# Altium schematic sheet STLINK_V3EC.SchDoc: STLINK-V3EC
size A3; Date: Not used; ApprovedBy: Not used; CheckedBy: Not used; Author: Not used; CompanyName: STMicroelectronics; DrawnBy: Not used; Engineer: Not used; Organization: Not used; Address1: Not used; Address2: Not used; Address3: Not used; Address4: Not used; DocumentNumber: Not used; Revision: V0.1; SheetNumber: 18; SheetTotal: 18; CurrentTime: Not used; CurrentDate: Not used; Time: Not used; DocumentFullPathAndName: Not used; DocumentName: Not used; ModifiedDate: Not used; ImagePath: Not used; ProjectName: Not used; Application_BuildNumber: Not used
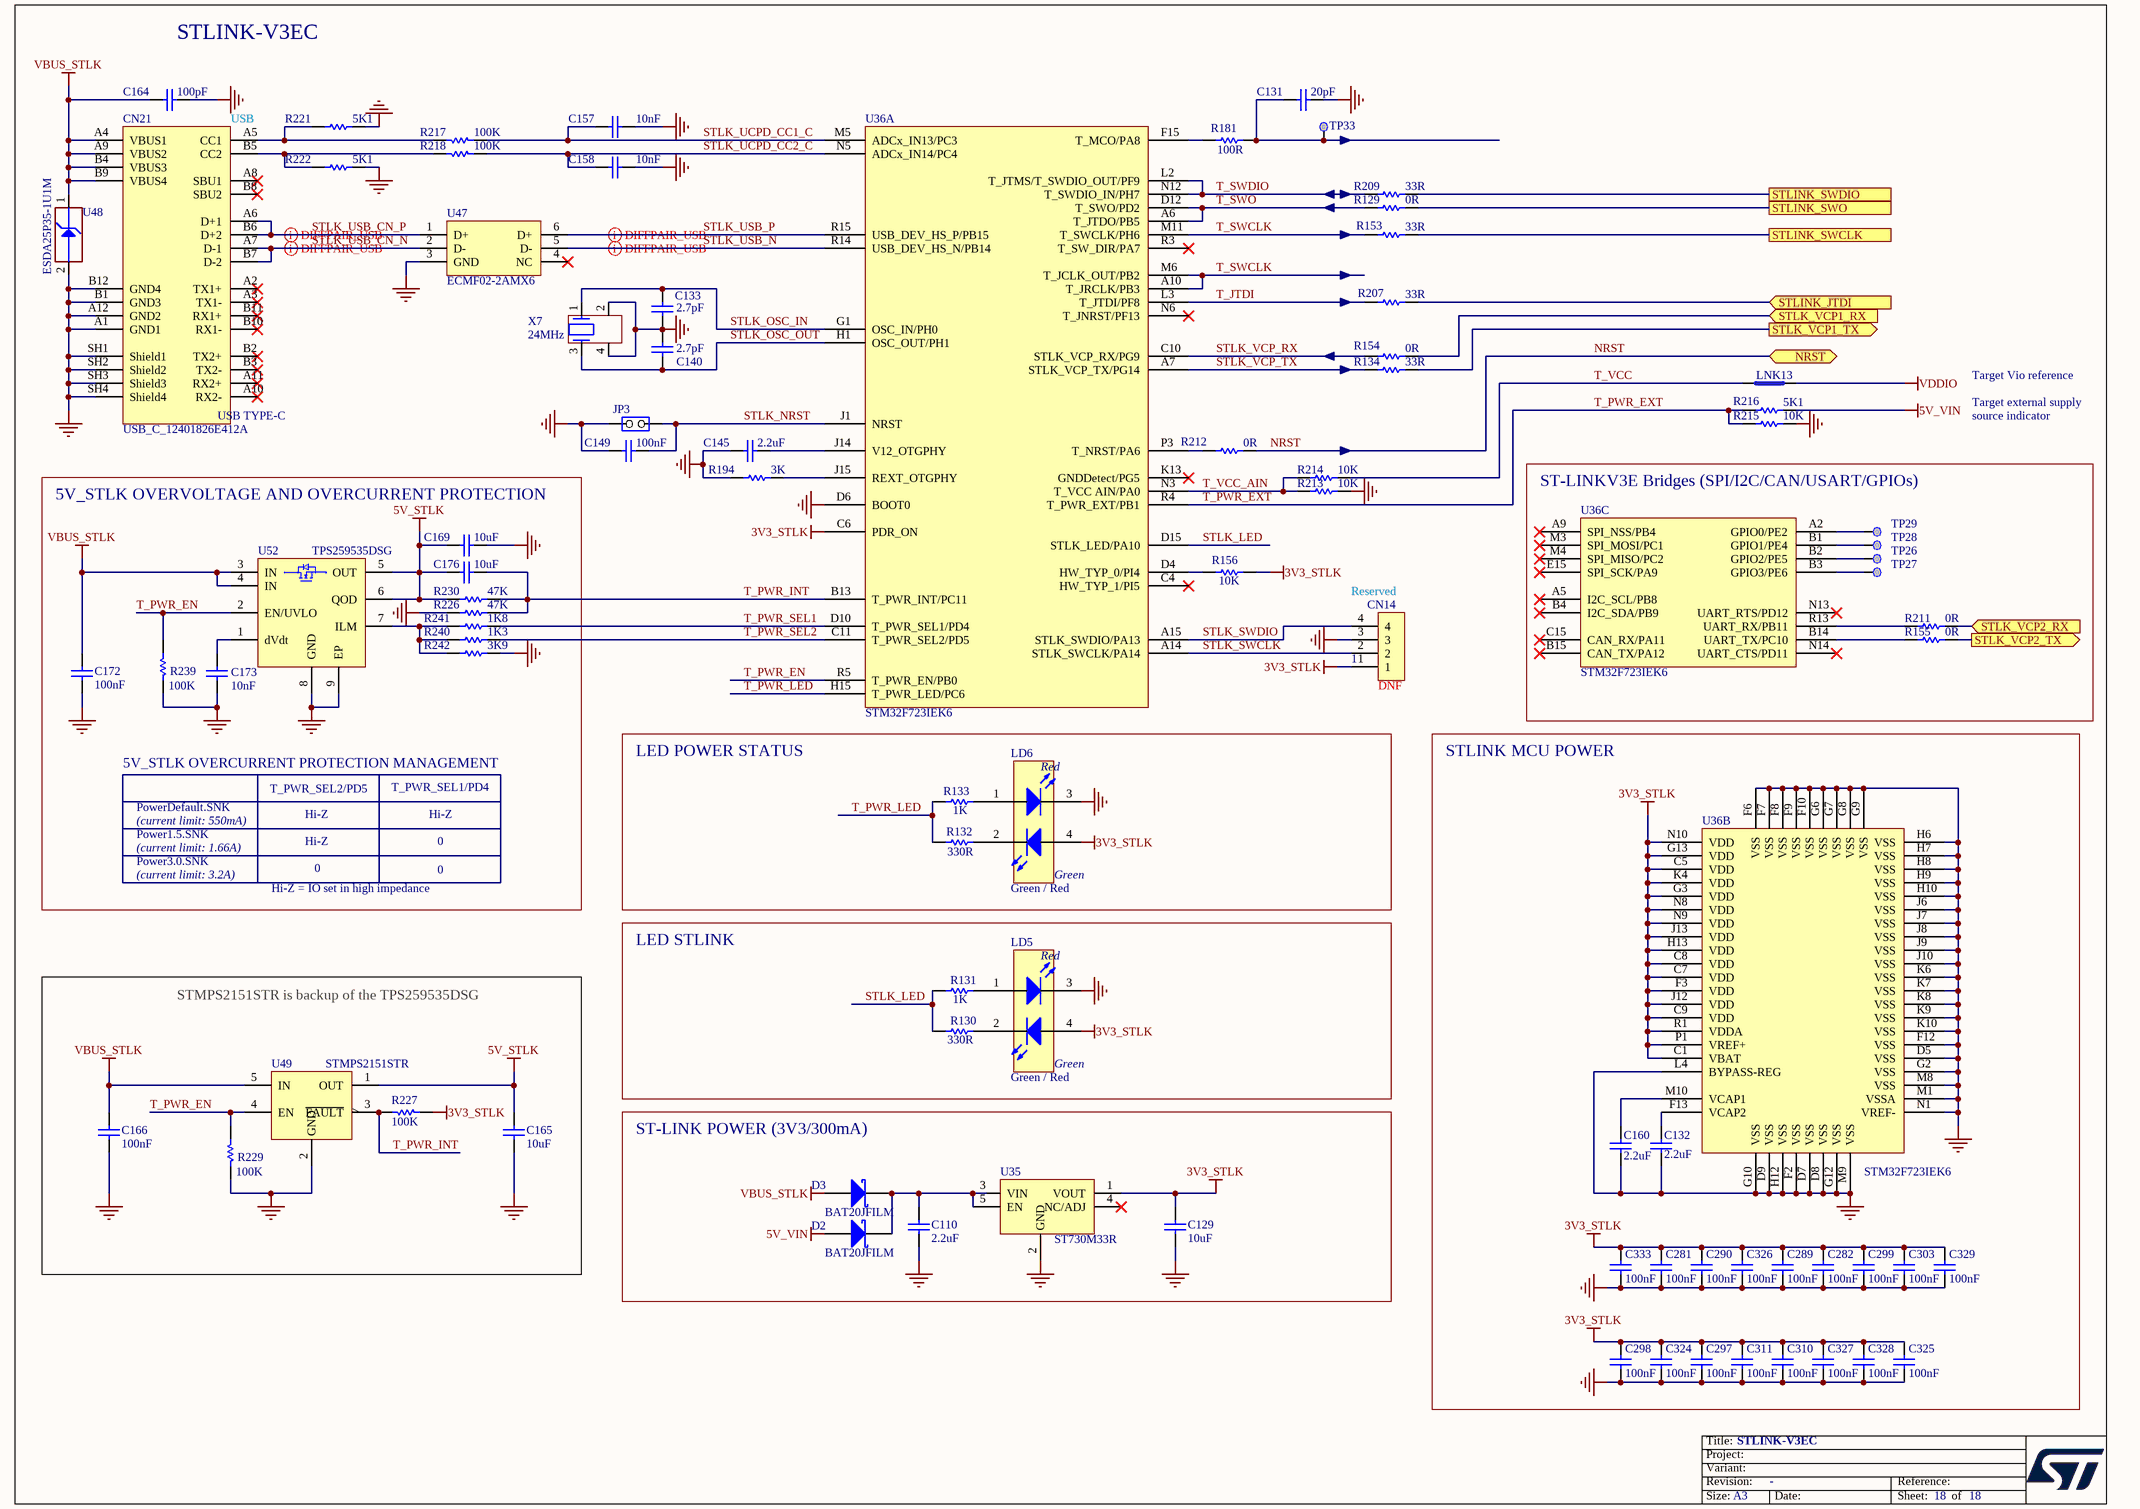
[diagram p0: STLINK_V3EC.SchDoc]

## Parts
C110  value 2.2uF  [C0805]  (hidden comment: Capacitor)
C129  value 10uF  [C0603]  (hidden comment: Capacitor)
C131  value 20pF  [C0402]  (hidden comment: Capacitor)
C132  value 2.2uF  [C0402]  (hidden comment: Capacitor)
C133  value 2.7pF  [C0402]  (hidden comment: Capacitor)
C140  value 2.7pF  [C0402]  (hidden comment: Capacitor)
C145  value 2.2uF  [C0402]  (hidden comment: Capacitor)
C149  value 100nF  [C0402]  (hidden comment: Capacitor)
C157  value 10nF  [C0402]  (hidden comment: Capacitor)
C158  value 10nF  [C0402]  (hidden comment: Capacitor)
C160  value 2.2uF  [C0402]  (hidden comment: Capacitor)
C164  value 100pF  [C0402]  (hidden comment: Capacitor)
C165  value 10uF  [C0603]  (hidden comment: Capacitor)
C166  value 100nF  [C0402]  (hidden comment: Capacitor)
C169  value 10uF  [C0603]  (hidden comment: Capacitor)
C172  value 100nF  [C0402]  (hidden comment: Capacitor)
C173  value 10nF  [C0402]  (hidden comment: Capacitor)
C176  value 10uF  [C0402]  (hidden comment: Capacitor)
C281  value 100nF  [C0402]  (hidden comment: Capacitor)
C282  value 100nF  [C0402]  (hidden comment: Capacitor)
C289  value 100nF  [C0402]  (hidden comment: Capacitor)
C290  value 100nF  [C0402]  (hidden comment: Capacitor)
C297  value 100nF  [C0402]  (hidden comment: Capacitor)
C298  value 100nF  [C0402]  (hidden comment: Capacitor)
C299  value 100nF  [C0402]  (hidden comment: Capacitor)
C303  value 100nF  [C0402]  (hidden comment: Capacitor)
C310  value 100nF  [C0402]  (hidden comment: Capacitor)
C311  value 100nF  [C0402]  (hidden comment: Capacitor)
C324  value 100nF  [C0402]  (hidden comment: Capacitor)
C325  value 100nF  [C0402]  (hidden comment: Capacitor)
C326  value 100nF  [C0402]  (hidden comment: Capacitor)
C327  value 100nF  [C0402]  (hidden comment: Capacitor)
C328  value 100nF  [C0402]  (hidden comment: Capacitor)
C329  value 100nF  [C0402]  (hidden comment: Capacitor)
C333  value 100nF  [C0402]  (hidden comment: Capacitor)
CN14  Header 4x1  [CON_SAMTEC_TSW-104-07-G-S]  (value not drawn)
CN21  value USB_C_12401826E412A  [CON_USB-TYPEC_AMPHENOL_12401826E412A]  (hidden comment: USB_TYPE_C_Receptacle)
D2  value BAT20JFILM  [DIO_SOD323_1A_2K]  (hidden comment: SCHOTTKY_1A_2K)
D3  value BAT20JFILM  [DIO_SOD323_1A_2K]  (hidden comment: SCHOTTKY_1A_2K)
JP3  Jumper_Header 2x1  [CON_SAMTEC_TSW-102-07-G-S]  (value not drawn)
LD5  value Green / Red  [LED_BI-GR_WE-150141SV73110]  (hidden comment: LED_BICOLOR)
LD6  value Green / Red  [LED_BI-GR_WE-150141SV73110]  (hidden comment: LED_BICOLOR)
LNK13  link_200  [LINK200]  (value not drawn)  (no BOM)
R129  value 0R  [R0402]  (hidden comment: Resistor)
R130  value 330R  [R0402]  (hidden comment: Resistor)
R131  value 1K  [R0402]  (hidden comment: Resistor)
R132  value 330R  [R0402]  (hidden comment: Resistor)
R133  value 1K  [R0402]  (hidden comment: Resistor)
R134  value 33R  [R0402]  (hidden comment: Resistor)
R153  value 33R  [R0402]  (hidden comment: Resistor)
R154  value 0R  [R0402]  (hidden comment: Resistor)
R155  value 0R  [R0402]  (hidden comment: Resistor)
R156  value 10K  [R0402]  (hidden comment: Resistor)
R181  value 100R  [R0402]  (hidden comment: Resistor)
R194  value 3K  [R0402]  (hidden comment: Resistor)
R207  value 33R  [R0402]  (hidden comment: Resistor)
R209  value 33R  [R0402]  (hidden comment: Resistor)
R211  value 0R  [R0402]  (hidden comment: Resistor)
R212  value 0R  [R0402]  (hidden comment: Resistor)
R213  value 10K  [R0402]  (hidden comment: Resistor)
R214  value 10K  [R0402]  (hidden comment: Resistor)
R215  value 10K  [R0402]  (hidden comment: Resistor)
R216  value 5K1  [R0402]  (hidden comment: Resistor)
R217  value 100K  [R0402]  (hidden comment: Resistor)
R218  value 100K  [R0402]  (hidden comment: Resistor)
R221  value 5K1  [R0402]  (hidden comment: Resistor)
R222  value 5K1  [R0402]  (hidden comment: Resistor)
R226  value 47K  [R0402]  (hidden comment: Resistor)
R227  value 100K  [R0402]  (hidden comment: Resistor)
R229  value 100K  [R0402]  (hidden comment: Resistor)
R230  value 47K  [R0402]  (hidden comment: Resistor)
R239  value 100K  [R0402]  (hidden comment: Resistor)
R240  value 1K3  [R0402]  (hidden comment: Resistor)
R241  value 1K8  [R0402]  (hidden comment: Resistor)
R242  value 3K9  [R0402]  (hidden comment: Resistor)
TP26  Test Point  [TP_SMD_1MM]  (value not drawn)  (no BOM)
TP27  Test Point  [TP_SMD_1MM]  (value not drawn)  (no BOM)
TP28  Test Point  [TP_SMD_1MM]  (value not drawn)  (no BOM)
TP29  Test Point  [TP_SMD_1MM]  (value not drawn)  (no BOM)
TP33  Test Point  [TP_SMD_1MM]  (value not drawn)  (no BOM)
U35  ST730M33R  [ICC_SOT23-5L_H1P45]
U36  value STM32F723IEK6  [ICC_UFBGA201_176+25_10X10_P065]  (hidden comment: STLINK-V3EC)  (parts A,B,C of 3)
U47  value ECMF02-2AMX6  [ESD_QFN-6L_1P7X1P5_P050]  (hidden comment: ​)
U48  value ESDA25P35-1U1M  [ESD_QFN1610_2N_1K_2A]  (hidden comment: ESD-TRANSIL)
U49  STMPS2151STR  [MOS_SOT23-5L]
U52  TPS259535DSG  [ICC_WSON8-EPAD_2X2_P050]
X7  value 24MHz  [CRY_NX2016SA_4P]  (hidden comment: XTAL_4_PINS)

## Blocks framed on the sheet
5V_STLK OVERVOLTAGE AND OVERCURRENT PROTECTION: C169 C172 C173 C176 R226 R230 R239-R242 U52
ST-LINKV3E Bridges (SPI/I2C/CAN/USART/GPIOs): R155 R211 TP26-TP29 U36
LED POWER STATUS: LD6 R132 R133
STLINK MCU POWER: C132 C160 C281 C282 C289 C290 C297-C299 C303 C310 C311 C324-C329 C333 U36
LED STLINK: LD5 R130 R131
STMPS2151STR is backup of the TPS259535DSG: C165 C166 R227 R229 U49
ST-LINK POWER (3V3/300mA): C110 C129 D2 D3 U35

## Ports
NRST (bidir), STLINK_JTDI (in), STLINK_SWCLK, STLINK_SWDIO, STLINK_SWO, STLK_VCP1_RX (in), STLK_VCP1_TX (out), STLK_VCP2_RX (in), STLK_VCP2_TX (out)

## Nets
3V3_STLK: C129.2 C281.1 C282.1 C289.1 C290.1 C297.1 C298.1 C299.1 C303.1 C310.1 C311.1 C324.1 C325.1 C326.1 C327.1 C328.1 C329.1 C333.1 CN14.1 LD5.4(Green_anode) LD6.4(Green_anode) R156.2 R227.1 U35.1(VOUT) U36.C1(VBAT) U36.C5(VDD) U36.C6(PDR_ON) U36.C7(VDD) U36.C8(VDD) U36.C9(VDD) U36.F3(VDD) U36.G3(VDD) U36.G13(VDD) U36.H13(VDD) U36.J12(VDD) U36.J13(VDD) U36.K4(VDD) U36.N8(VDD) U36.N9(VDD) U36.N10(VDD) U36.P1(VREF+) U36.R1(VDDA)
5V_STLK: C165.2 C169.2 C176.1 R230.1 U49.1(OUT) U52.5(OUT) U52.6(QOD)
5V_VIN: D2.1(A) R216.2
GND: C110.1 C129.1 C131.1 C132.1 C133.2 C140.1 C145.1 C149.1 C157.2 C158.2 C160.1 C164.2 C165.1 C166.1 C169.1 C172.1 C173.1 C281.2 C282.2 C289.2 C290.2 C297.2 C298.2 C299.2 C303.2 C310.2 C311.2 C324.2 C325.2 C326.2 C327.2 C328.2 C329.2 C333.2 CN14.3 CN21.A1(GND1) CN21.A12(GND2) CN21.B1(GND3) CN21.B12(GND4) CN21.SH1(Shield1) CN21.SH2(Shield2) CN21.SH3(Shield3) CN21.SH4(Shield4) JP3.2(NO) LD5.3(RED_cathode) LD6.3(RED_cathode) R194.2 R213.2 R215.2 R221.2 R222.2 R226.2 R229.1 R239.1 R242.2 U35.2(GND) U36.D5(VSS) U36.D6(BOOT0) U36.D7(VSS) U36.D8(VSS) U36.D9(VSS) U36.F2(VSS) U36.F6(VSS) U36.F7(VSS) U36.F8(VSS) U36.F9(VSS) U36.F10(VSS) U36.F12(VSS) U36.G2(VSS) U36.G6(VSS) U36.G7(VSS) U36.G8(VSS) U36.G9(VSS) U36.G10(VSS) U36.G12(VSS) U36.H6(VSS) U36.H7(VSS) U36.H8(VSS) U36.H9(VSS) U36.H10(VSS) U36.H12(VSS) U36.J6(VSS) U36.J7(VSS) U36.J8(VSS) U36.J9(VSS) U36.J10(VSS) U36.K6(VSS) U36.K7(VSS) U36.K8(VSS) U36.K9(VSS) U36.K10(VSS) U36.L4(BYPASS-REG) U36.M1(VSSA) U36.M8(VSS) U36.M9(VSS) U36.N1(VREF-) U47.3(GND) U48.2(GND) U49.2(GND) U52.8(GND) U52.9(EP) X7.2 X7.4
VBUS_STLK: C164.1 C166.2 C172.2 CN21.A4(VBUS1) CN21.A9(VBUS2) CN21.B4(VBUS3) CN21.B9(VBUS4) D3.1(A) U48.1(IO1) U49.5(IN) U52.3(IN) U52.4(IN)
VDDIO: LNK13.1
NRST: R212.2 ; port NRST
STLINK_JTDI: R207.2 ; port STLINK_JTDI
STLINK_SWCLK: R153.2 ; port STLINK_SWCLK
STLINK_SWDIO: R209.2 ; port STLINK_SWDIO
STLINK_SWO: R129.2 ; port STLINK_SWO
STLK_LED: R130.1 R131.2 U36.D15(STLK_LED/PA10)
STLK_NRST: C149.2 JP3.1(COMMON) U36.J1(NRST)
STLK_OSC_IN: C133.1 U36.G1(OSC_IN/PH0) X7.1
STLK_OSC_OUT: C140.2 U36.H1(OSC_OUT/PH1) X7.3
STLK_SWCLK: CN14.2 U36.A14(STLK_SWCLK/PA14)
STLK_SWDIO: CN14.4 U36.A15(STLK_SWDIO/PA13)
STLK_UCPD_CC1_C: C157.1 R217.1 U36.M5(ADCx_IN13/PC3)
STLK_UCPD_CC2_C: C158.1 R218.1 U36.N5(ADCx_IN14/PC4)
STLK_USB_CN_N: CN21.A7(D-1) CN21.B7(D-2) U47.2(D-)
STLK_USB_CN_P: CN21.A6(D+1) CN21.B6(D+2) U47.1(D+)
STLK_USB_N: U36.R14(USB_DEV_HS_N/PB14) U47.5(D-)
STLK_USB_P: U36.R15(USB_DEV_HS_P/PB15) U47.6(D+)
STLK_VCP1_RX: R154.2 ; port STLK_VCP1_RX
STLK_VCP1_TX: R134.2 ; port STLK_VCP1_TX
STLK_VCP2_RX: R211.1 ; port STLK_VCP2_RX
STLK_VCP2_TX: R155.1 ; port STLK_VCP2_TX
STLK_VCP_RX: R154.1 U36.C10(STLK_VCP_RX/PG9)
STLK_VCP_TX: R134.1 U36.A7(STLK_VCP_TX/PG14)
T_JTDI: R207.1 U36.L3(T_JTDI/PF8)
T_PWR_EN: R229.2 R239.2 U36.R5(T_PWR_EN/PB0) U49.4(EN) U52.2(EN/UVLO)
T_PWR_EXT: R215.1 R216.1 U36.R4(T_PWR_EXT/PB1)
T_PWR_INT: C176.2 R226.1 R227.2 R230.2 U36.B13(T_PWR_INT/PC11) U49.3(~{FAULT})
T_PWR_LED: R132.2 R133.2 U36.H15(T_PWR_LED/PC6)
T_PWR_SEL1: R241.2 U36.D10(T_PWR_SEL1/PD4)
T_PWR_SEL2: R240.2 U36.C11(T_PWR_SEL2/PD5)
T_SWCLK: R153.1 U36.A10(T_JRCLK/PB3) U36.M6(T_JCLK_OUT/PB2) U36.M11(T_SWCLK/PH6)
T_SWDIO: R209.1 U36.L2(T_JTMS/T_SWDIO_OUT/PF9) U36.N12(T_SWDIO_IN/PH7)
T_SWO: R129.1 U36.A6(T_JTDO/PB5) U36.D12(T_SWO/PD2)
T_VCC: LNK13.2 R214.2
T_VCC_AIN: R213.1 R214.1 U36.N3(T_VCC_AIN/PA0)
NetC110_2: C110.2 D2.2(K) D3.2(K) U35.3(VIN) U35.5(EN)
NetC131_2: C131.2 R181.2 TP33.1
NetC132_2: C132.2 U36.F13(VCAP2)
NetC145_2: C145.2 U36.J14(V12_OTGPHY)
NetC160_2: C160.2 U36.M10(VCAP1)
NetC173_2: C173.2 U52.1(dVdt)
NetCN21_A5: CN21.A5(CC1) R217.2 R221.1
NetCN21_B5: CN21.B5(CC2) R218.2 R222.1
NetLD5_1: LD5.1(Red_anode) R131.1
NetLD5_2: LD5.2(Green_cathode) R130.2
NetLD6_1: LD6.1(Red_anode) R133.1
NetLD6_2: LD6.2(Green_cathode) R132.1
NetR155_2: R155.2 U36.B14(UART_TX/PC10)
NetR156_1: R156.1 U36.D4(HW_TYP_0/PI4)
NetR181_1: R181.1 U36.F15(T_MCO/PA8)
NetR194_1: R194.1 U36.J15(REXT_OTGPHY)
NetR211_2: R211.2 U36.R13(UART_RX/PB11)
NetR212_1: R212.1 U36.P3(T_NRST/PA6)
NetR240_1: R240.1 R241.1 R242.1 U52.7(ILM)
NetTP26_1: TP26.1 U36.B2(GPIO2/PE5)
NetTP27_1: TP27.1 U36.B3(GPIO3/PE6)
NetTP28_1: TP28.1 U36.B1(GPIO1/PE4)
NetTP29_1: TP29.1 U36.A2(GPIO0/PE2)

Not connected (* = marked no-connect by the designer): CN21 A2(TX1+)* A3(TX1-)* A8(SBU1)* A10(RX2-)* A11(RX2+)* B2(TX2+)* B3(TX2-)* B8(SBU2)* B10(RX1-)* B11(RX1+)*; U35 4(NC/ADJ)*; U36 A5(I2C_SCL/PB8)* A9(SPI_NSS/PB4)* B4(I2C_SDA/PB9)* B15(CAN_TX/PA12)* C4(HW_TYP_1/PI5)* C15(CAN_RX/PA11)* E15(SPI_SCK/PA9)* K13(GNDDetect/PG5)* M3(SPI_MOSI/PC1)* M4(SPI_MISO/PC2)* N6(T_JNRST/PF13)* N13(UART_RTS/PD12)* N14(UART_CTS/PD11)* R3(T_SW_DIR/PA7)*; U47 4(NC)*

## Layout directives
differential pair; rule Impedance Constraint [Min = 85.00    Max = 95.00    ]: STLK_USB_CN_N, STLK_USB_CN_P, STLK_USB_N, STLK_USB_P

## Notes on the sheet
- STLINK-V3EC
- (near CN21) USB
- Target Vio reference
- Target external supply
- source indicator
- (near CN14) Reserved
- (near CN14) 1
- (near CN14) DNF
- 5V_STLK OVERCURRENT PROTECTION MANAGEMENT
- (current limit: 550mA)
- (current limit: 1.66A)
- Power1.5.SNK
- PowerDefault.SNK
- T_PWR_SEL2/PD5
- Hi-Z
- T_PWR_SEL1/PD4
- 0
- (current limit: 3.2A)
- Power3.0.SNK
- Hi-Z = IO set in high impedance
- Title:
- Project:
- Size:
- Revision:
- Variant:
- A3
- -
- Date:
- Reference:
- Sheet:
- of
- (in symbol MCD-02631) Red; Green
- (in symbol MCD-03232) USB TYPE-C

## Library data of the parts
C110 = MCD-02372: Capacitor, MLCC, 2.2uF, 25V, X7R, +/-10%, 0805, T=1,25mm; Manufacturer_Part_Number: GRM21BR71E225KE11L; Manufacturer: MURATA; Part_Preference: Recommended; Component_Country_Of_Origin: Japan; ShowFields: YES; ID: 4478; Internal_Part_Number: MCD-02372; Status: Released; Part_Type: Capacitor; Package: 0805; ComponentLink1URL: http://tunmcdsvn.tun.st.com/Component_Documentation_Library/Trunk/Capacitor/MURATA_GRM_Series/GRM21BR71E225KE11; Order_Code_Digikey: 490-14467; Order_Code_Farnell: 2688538; Order_Code_RS: N/A
C129 C169 = MCD-00099: Capacitor, MLCC, 10uF, 10V, X5R, +/-10%, 0603, T=0.8mm; Part_Preference: Recommended; Manufacturer: MURATA; Manufacturer_Part_Number: GRM188R61A106KE69D; Order_Code_RS: 170-6168; Component_Country_Of_Origin: Japan; ShowFields: YES; ID: 2770; Internal_Part_Number: MCD-00099; Status: Released; Part_Type: Capacitor; Package: 0603; ComponentLink1URL: http://tunmcdsvn.tun.st.com/Component_Documentation_Library/Trunk/Capacitor/MURATA_GRM_Series; Order_Code_Digikey: 490-10474-1-ND; Order_Code_Farnell: 2494233
C131 = MCD-00016: Capacitor, MLCC, 20pF, 50V, NPO, +/- 5%, 0402, T=0.5mm; Manufacturer_Part_Number: CC0402JRNPO9BN200; Manufacturer: YAGEO; Part_Preference: Recommended; Component_Country_Of_Origin: China; ShowFields: YES; ID: 2479; Internal_Part_Number: MCD-00016; Status: Released; Package: 0402; Part_Type: Capacitor; ComponentLink1URL: http://tunmcdsvn.tun.st.com/Component_Documentation_Library/Trunk/Capacitor/YAGEO_NP0_Series; Order_Code_Digikey: 311-1417-1-ND; Order_Code_Farnell: N/A; Order_Code_RS: N/A
C132 C145 C160 = MCD-02606: Capacitor, MLCC, 2.2uF, 6.3V, X5R, +/-10%, 0402, T=0.5mm; Part_Preference: Recommended; Manufacturer: YAGEO; Manufacturer_Part_Number: CC0402KRX5R5BB225; Order_Code_RS: 1992205; ShowFields: YES; ID: 4712; Internal_Part_Number: MCD-02606; Status: New; Part_Type: Capacitor; Package: 0402; ComponentLink1URL: http://tunmcdsvn.tun.st.com/Component_Documentation_Library/Trunk/Capacitor/YAGEO_X5R_Series; Order_Code_Digikey: 311-1682-2-ND; Order_Code_Farnell: 3366429
C133 C140 = MCD-01774: Capacitor, MLCC, 2.7pF, 50V, NPO, +/-0.1pF, 0402, T=0.5mm; Part_Preference: Recommended; Manufacturer: YAGEO; Manufacturer_Part_Number: CC0402BRNPO9BN2R7; Component_Country_Of_Origin: China; ID: 3874; ShowFields: YES; Internal_Part_Number: MCD-01774; Status: Released; Part_Type: Capacitor; Package: 0402; ComponentLink1URL: http://tunmcdsvn.tun.st.com/Component_Documentation_Library/Trunk/Capacitor/YAGEO_NP0_Series; Order_Code_Digikey: 311-1619-1-ND; Order_Code_Farnell: N/A; Order_Code_RS: N/A
C149 C281 C282 C289 C290 C297-C299 C303 C310 C311 C324-C329 C333 = MCD-00006: Capacitor, MLCC, 100nF, 16V, X7R, +/-10%, 0402, T=0.5mm; Manufacturer_Part_Number: CC0402KRX7R7BB104; Manufacturer: YAGEO; Part_Preference: Recommended; Order_Code_RS: 616-9701; Component_Country_Of_Origin: China; ShowFields: YES; ID: 2474; Internal_Part_Number: MCD-00006; Status: Released; Package: 0402; Part_Type: Capacitor; ComponentLink1URL: http://tunmcdsvn.tun.st.com/Component_Documentation_Library/Trunk/Capacitor/YAGEO_X7R_Series; Order_Code_Digikey: 311-1338-1-ND; Order_Code_Farnell: 9402047
C157 C158 C173 = MCD-02198: Capacitor, MLCC, 10nF, 50V, X7R, +/-10%, 0402, T=0.5mm; Part_Preference: Recommended; Manufacturer: YAGEO; Manufacturer_Part_Number: CC0402KRX7R9BB103; Order_Code_RS: 6169644; Component_Country_Of_Origin: China; ShowFields: YES; ID: 4298; Internal_Part_Number: MCD-02198; Status: Checked; Part_Type: Capacitor; Package: 0402; ComponentLink1URL: http://tunmcdsvn.tun.st.com/Component_Documentation_Library/Trunk/Capacitor/YAGEO_X7R_Series; Order_Code_Digikey: N/A; Order_Code_Farnell: N/A
C164 = MCD-00205: Capacitor, MLCC, 100pF, 50V, NPO, +/-5%, 0402, T=0.5mm; Part_Preference: Recommended; Manufacturer: YAGEO; Manufacturer_Part_Number: CC0402JRNPO9BN101; Component_Country_Of_Origin: China; ShowFields: YES; ID: 2658; Internal_Part_Number: MCD-00205; Status: Released; Part_Type: Capacitor; Package: 0402; ComponentLink1URL: http://tunmcdsvn.tun.st.com/Component_Documentation_Library/Trunk/Capacitor/YAGEO_NP0_Series; Order_Code_Digikey: 311-1024-1-ND; Order_Code_Farnell: 3019226RL; Order_Code_RS: N/A
C165 = MCD-00099: Capacitor, MLCC, 10uF, 10V, X5R, +/-10%, 0603, T=0.8mm; Part_Preference: Recommended; Manufacturer: MURATA; Manufacturer_Part_Number: GRM188R61A106KE69D; Order_Code_RS: 170-6168; Component_Country_Of_Origin: Japan; ID: 2770; ShowFields: YES; Internal_Part_Number: MCD-00099; Status: Released; Part_Type: Capacitor; Package: 0603; ComponentLink1URL: http://tunmcdsvn.tun.st.com/Component_Documentation_Library/Trunk/Capacitor/MURATA_GRM_Series; Order_Code_Digikey: 490-10474-1-ND; Order_Code_Farnell: 2494233
C166 C172 = MCD-02355: Capacitor, MLCC, 100nF, 25V, X7R, +/-10%, 0402, T=0.5mm; Part_Preference: Recommended; Manufacturer: WALSIN; Manufacturer_Part_Number: 0402B104K250CT; Order_Code_RS: 176-3114; Component_Country_Of_Origin: Unknown; ShowFields: YES; ID: 4461; Internal_Part_Number: MCD-02355; Status: Released; Part_Type: Capacitor; Package: 0402; ComponentLink1URL: http://tunmcdsvn.tun.st.com/Component_Documentation_Library/Trunk/Capacitor/WALSIN_Monolithic_Series/; Order_Code_Digikey: 1292-1175-1-ND; Order_Code_Farnell: 2496772
C176 = MCD-03140: Capacitor, MLCC, 10uF, 6.3V, X5R, +/-20%, 0402, T=0.5mm; Part_Preference: Recommended; Manufacturer: MURATA; Manufacturer_Part_Number: GRM155R60J106ME05D; Component_Country_Of_Origin: China, Japan; ShowFields: YES; ID: 5256; Internal_Part_Number: MCD-03140; Status: Released; Part_Type: Capacitor; Package: 0402; ComponentLink1URL: http://tunmcdsvn.tun.st.com/Component_Documentation_Library/Trunk/Capacitor/MURATA_GRM_Series; Order_Code_Digikey: 490-GRM155R60J106ME05DTR-ND; Order_Code_Farnell: 3784428; Order_Code_RS: N/A
CN14 = MCD-00029: Header, 4x1, 2.54mm, VR, TH, T=5.84mm/2.54mm; Manufacturer_Part_Number: TSW-104-07-G-S; Manufacturer: SAMTEC; Part_Type: Connector; Part_Preference: Recommended; Order_Code_RS: 161-2261; Component_Country_Of_Origin: China, Costa Rica, Malaysia, United States, Vietnam; ShowFields: YES; ID: 2487; Internal_Part_Number: MCD-00029; Status: Released; ComponentLink1URL: http://tunmcdsvn.tun.st.com/Component_Documentation_Library/Trunk/Connector/SAMTEC_TSW_Series/; Value: Header 4x1; Order_Code_Digikey: TSW-104-07-G-S-ND; Order_Code_Farnell: 2667450
CN21 = MCD-03232: USB_TypeC, 24 pins, RA, SMD, T=2.96mm; Part_Type: Connector; Part_Preference: Recommended; Manufacturer: AMPHENOL ICC; Manufacturer_Part_Number: 12401826E412A; Component_Country_Of_Origin: China°; ShowFields: YES; ID: 5348; Internal_Part_Number: MCD-03232; Status: Released; ComponentLink1URL: http://tunmcdsvn.tun.st.com/Component_Documentation_Library/Trunk/Connector/AMPHEMOL_ICC_12401826E412A; Order_Code_Digikey: 12401826E412ATR-ND; Order_Code_Farnell: 3727763; Order_Code_RS: N/A
D2 D3 = MCD-03011: Signal Schottky Diode, If=1A, Ifsm=5A, Vf =0.54V@1A, Vrrm=23V, Ir = 0.65µA@5V, SOD-323; Part_Preference: Recommended; Manufacturer: STMICROELECTRONICS; Order_Code_RS: 165-7545; ShowFields: YES; ID: 5127; Internal_Part_Number: MCD-03011; Status: New; Part_Type: Diode; Manufacturer_Part_Number: BAT20JFILM; Package: SOD-323; ComponentLink1URL: http://tunmcdsvn.tun.st.com/Component_Documentation_Library/Trunk/Diode/STMICROELECTRONICS_BAT20J; Order_Code_Digikey: 497-3381-2-ND; Order_Code_Farnell: 2354440
JP3 = MCD-00045: Header, 2x1, 2.54mm, VR, TH, T=5.84mm/2.54mm; Part_Preference: Recommended; Part_Type: Connector; Manufacturer: SAMTEC; Manufacturer_Part_Number: TSW-102-07-G-S; Alternate_Internal_Part_Number: MCD-02390; Order_Code_RS: 155-5312; Component_Country_Of_Origin: China, Costa Rica, Malaysia, United States, Vietnam; ShowFields: YES; ID: 2545; Internal_Part_Number: MCD-00045; Status: Released; ComponentLink1URL: http://tunmcdsvn.tun.st.com/Component_Documentation_Library/Trunk/Connector/SAMTEC_TSW_Series/; Value: Header 2x1; Order_Code_Digikey: SAM1029-02-ND; Order_Code_Farnell: 2505044; Full_Alternate_Internal_Part_Number: MCD-02390
LD5 LD6 = MCD-02631: LED Bicolor, Green/Red, 2V, 20mA,  4-PLCC; Part_Type: Display; Part_Preference: Recommended; Manufacturer: WURTH ELEKTRONIK; Manufacturer_Part_Number: 150141SV73110; Order_Code_RS: 184-6963; Component_Country_Of_Origin: China; ShowFields: YES; ID: 4737; Internal_Part_Number: MCD-02631; Status: Checked; Package: 4-PLCC; ComponentLink1URL: http://tunmcdsvn.tun.st.com/Component_Documentation_Library/Trunk/Display/WURTH_ELEKTRONIK_150141SV73110; Order_Code_Digikey: 732-13404-2-ND; Order_Code_Farnell: 2990869
LNK13 = MCD-02777: Track link on PCB 200um width for layout routing. No component assembly and no component in BOM; Part_Type: Misc; Part_Preference: Recommended; ShowFields: YES; ID: 4889; Value: link_200; Internal_Part_Number: MCD-02777; Status: Checked; Manufacturer: N/A; Manufacturer_Part_Number: link_200; ComponentLink1URL: http://tunmcdsvn.tun.st.com/Component_Documentation_Library/Trunk; Order_Code_Digikey: N/A; Order_Code_Farnell: N/A; Order_Code_RS: N/A
R129 R154 R212 = MCD-00052: Resistor, 0R, 0402, +/-5%, 1/16W; Part_Preference: Recommended; Manufacturer: YAGEO; Manufacturer_Part_Number: RC0402JR-070RL; Order_Code_RS: 618-5804; Component_Country_Of_Origin: China; ShowFields: YES; ID: 2540; Internal_Part_Number: MCD-00052; Status: Released; Part_Type: Resistor; Package: 0402; ComponentLink1URL: http://tunmcdsvn.tun.st.com/Component_Documentation_Library/Trunk/Resistor/YAGEO_RC_L_Series; Order_Code_Digikey: 311-0.0JRCT-ND; Order_Code_Farnell: 9232516RL
R130 R132 = MCD-00062: Resistor, 330R, 0402, +/-1%, 1/16W; Part_Preference: Recommended; Manufacturer: YAGEO; Manufacturer_Part_Number: RC0402FR-07330RL; Component_Country_Of_Origin: China; ShowFields: YES; ID: 2529; Internal_Part_Number: MCD-00062; Status: Released; Part_Type: Resistor; Package: 0402; ComponentLink1URL: http://tunmcdsvn.tun.st.com/Component_Documentation_Library/Trunk/Resistor/YAGEO_RC_L_Series; Order_Code_Digikey: 311-330LRCT-ND; Order_Code_Farnell: 9239170; Order_Code_RS: N/A
R131 R133 = MCD-02665: Resistor, 1K, 0402, +/-0.1%, 1/16W, +/-25ppm/°C; Part_Preference: Recommended; Manufacturer: YAGEO; Manufacturer_Part_Number: RT0402BRD071KL; Order_Code_RS: 199-1298; ShowFields: YES; ID: 4771; Internal_Part_Number: MCD-02665; Status: Checked; Part_Type: Resistor; Package: 0402; ComponentLink1URL: http://tunmcdsvn.tun.st.com/Component_Documentation_Library/Trunk/Resistor/YAGEO_RT_Series; Order_Code_Digikey: YAG1386TR-ND; Order_Code_Farnell: 3496475
R134 R153 R207 R209 = MCD-00455: Resistor, 33R, 0402, +/-1%, 1/16W; Part_Preference: Recommended; Manufacturer: YAGEO; Manufacturer_Part_Number: RC0402FR-0733RL; Component_Country_Of_Origin: China; ShowFields: YES; ID: 2821; Internal_Part_Number: MCD-00455; Status: Released; Part_Type: Resistor; Package: 0402; ComponentLink1URL: http://tunmcdsvn.tun.st.com/Component_Documentation_Library/Trunk/Resistor/YAGEO_RC_L_Series; Order_Code_Digikey: 311-33.0LRCT-ND; Order_Code_Farnell: 9239057; Order_Code_RS: N/A
R155 R211 = MCD-00052: Resistor, 0R, 0402, +/-5%, 1/16W; Manufacturer_Part_Number: RC0402JR-070RL; Manufacturer: YAGEO; Part_Preference: Recommended; Order_Code_RS: 618-5804; Component_Country_Of_Origin: China; ShowFields: YES; ID: 2540; Internal_Part_Number: MCD-00052; Status: Released; Part_Type: Resistor; ComponentLink1URL: http://tunmcdsvn.tun.st.com/Component_Documentation_Library/Trunk/Resistor/YAGEO_RC_L_Series; Package: 0402; Order_Code_Digikey: 311-0.0JRCT-ND; Order_Code_Farnell: 9232516RL
R156 R213-R215 = MCD-00053: Resistor, 10K, 0402, +/-1%, 1/16W; Manufacturer_Part_Number: RC0402FR-0710KL; Manufacturer: YAGEO; BMS_Part_Number: 9131590; Part_Preference: Recommended; Component_Country_Of_Origin: China; ShowFields: YES; ID: 2539; Internal_Part_Number: MCD-00053; Status: Released; Part_Type: Resistor; ComponentLink1URL: http://tunmcdsvn.tun.st.com/Component_Documentation_Library/Trunk/Resistor/YAGEO_RC_L_Series; Package: 0402; Order_Code_Digikey: 311-10.0KLRCT-ND; Order_Code_Farnell: 9239359; Order_Code_RS: N/A
R181 = MCD-00067: Resistor, 100R, 0402, +/- 1%, 1/16W; Part_Preference: Recommended; Manufacturer: YAGEO; Manufacturer_Part_Number: RC0402FR-07100RL; Component_Country_Of_Origin: China; ShowFields: YES; ID: 2527; Internal_Part_Number: MCD-00067; Status: Released; Part_Type: Resistor; Package: 0402; ComponentLink1URL: http://tunmcdsvn.tun.st.com/Component_Documentation_Library/Trunk/Resistor/YAGEO_RC_L_Series; Order_Code_Digikey: 311-100LRCT-ND; Order_Code_Farnell: 9239111; Order_Code_RS: N/A
R194 = MCD-00185: Resistor, 3K, 0402, +/-1%, 1/16W; Manufacturer_Part_Number: RC0402FR-073KL; Manufacturer: YAGEO; Part_Preference: Recommended; Component_Country_Of_Origin: China; ShowFields: YES; ID: 2682; Internal_Part_Number: MCD-00185; Status: Released; Part_Type: Resistor; ComponentLink1URL: http://tunmcdsvn.tun.st.com/Component_Documentation_Library/Trunk/Resistor/YAGEO_RC_L_Series; Package: 0402; Order_Code_Digikey: 311-3KLRCT-ND; Order_Code_Farnell: 1458777; Order_Code_RS: N/A
R216 R221 R222 = MCD-00333: Resistor, 5K1, 0402, +/-1%, 1/16W; Part_Preference: Recommended; Manufacturer: YAGEO; Manufacturer_Part_Number: RC0402FR-075K1L; Component_Country_Of_Origin: China; ShowFields: YES; ID: 2944; Internal_Part_Number: MCD-00333; Status: Released; Part_Type: Resistor; Package: 0402; ComponentLink1URL: http://tunmcdsvn.tun.st.com/Component_Documentation_Library/Trunk/Resistor/YAGEO_RC_L_Series; Order_Code_Digikey: 311-5.10KLRCT-ND; Order_Code_Farnell: 1458805; Order_Code_RS: N/A
R217 R218 R227 R229 R239 = MCD-00059: Resistor, 100K, 0402, +/-1%, 1/16W; Manufacturer_Part_Number: RC0402FR-07100KL; Manufacturer: YAGEO; Part_Preference: Recommended; Component_Country_Of_Origin: China; ShowFields: YES; ID: 2533; Internal_Part_Number: MCD-00059; Status: Released; Part_Type: Resistor; Package: 0402; ComponentLink1URL: http://tunmcdsvn.tun.st.com/Component_Documentation_Library/Trunk/Resistor/YAGEO_RC_L_Series; Order_Code_Digikey: 311-100KLRTR-ND; Order_Code_Farnell: 2421891; Order_Code_RS: N/A
R226 R230 = MCD-00063: Resistor,47K,0402,1%,1/16W; Manufacturer_Part_Number: RC0402FR-0747KL; Manufacturer: YAGEO; Part_Preference: Recommended; ECCN_US: EAR99; ECCN_EU: NEC; Provided_By: SUBCO; Component_Country_Of_Origin: China; ID: 2528; ShowFields: YES; Internal_Part_Number: MCD-00063; ComponentLink1Description: Datasheet; Status: Released; Part_Type: Resistor; ComponentLink1URL: http://tunmcdsvn.tun.st.com/Component_Documentation_Library/Trunk/Resistor/YAGEO_RC_L_Series; Package: 0402; Alternate_Manufacturer: N/A; Alternate_Manufacturer_Part_Number: N/A; Order_Code_Digikey: 311-47.0KLRCT-ND; Order_Code_Farnell: 9239430; Order_Code_RS: N/A
R240 = MCD-00381: Resistor, 1K3, 0402, +/-1%, 1/16W; Part_Preference: Recommended; Manufacturer: YAGEO; Manufacturer_Part_Number: RC0402FR-071K3L; Component_Country_Of_Origin: China; ShowFields: YES; ID: 2898; Internal_Part_Number: MCD-00381; Status: Released; Part_Type: Resistor; Package: 0402; ComponentLink1URL: http://tunmcdsvn.tun.st.com/Component_Documentation_Library/Trunk/Resistor/YAGEO_RC_L_Series; Order_Code_Digikey: YAG3036CT-ND; Order_Code_Farnell: 1799176; Order_Code_RS: N/A
R241 = MCD-00409: Resistor, 1K8, 0402, +/-1%, 1/16W; Part_Preference: Recommended; Manufacturer: YAGEO; Manufacturer_Part_Number: RC0402FR-071K8L; Component_Country_Of_Origin: China; ShowFields: YES; ID: 2871; Internal_Part_Number: MCD-00409; Status: Released; Part_Type: Resistor; Package: 0402; ComponentLink1URL: http://tunmcdsvn.tun.st.com/Component_Documentation_Library/Trunk/Resistor/YAGEO_RC_L_Series; Order_Code_Digikey: 311-1.80KLRCT-ND; Order_Code_Farnell: 9239260; Order_Code_RS: N/A
R242 = MCD-02455: Resistor, 3K9, 0402, +/-1%, 1/16W, +/-100ppm/°C; Part_Preference: Recommended; Manufacturer: YAGEO; Manufacturer_Part_Number: RC0402FR-073K9L; Order_Code_RS: 198-7783; Component_Country_Of_Origin: China; ShowFields: YES; ID: 4561; Internal_Part_Number: MCD-02455; Status: Released; Part_Type: Resistor; Package: 0402; ComponentLink1URL: http://tunmcdsvn.tun.st.com/Component_Documentation_Library/Trunk/Resistor/YAGEO_RC0402_Series; Order_Code_Digikey: 311-3.90KLRTR-ND; Order_Code_Farnell: 9239308
TP26-TP29 = MCD-00074: Test Point 1mm; Part_Type: Misc; Part_Preference: Recommended; ID: 2518; ShowFields: YES; Internal_Part_Number: MCD-00074; Status: Released; Manufacturer_Part_Number: n/a; Manufacturer: n/a; ComponentLink1URL: http://na; Order_Code_Digikey: N/A; Order_Code_Farnell: N/A; Order_Code_RS: N/A
TP33 = MCD-00074: Test Point 1mm; Part_Type: Misc; Part_Preference: Recommended; ShowFields: YES; ID: 2518; Internal_Part_Number: MCD-00074; Status: Released; Manufacturer_Part_Number: N/A; Manufacturer: N/A; ComponentLink1URL: http://na; Order_Code_Digikey: N/A; Order_Code_Farnell: N/A; Order_Code_RS: N/A
U35 = MCD-02514: LDO, 3.3V, 300mA, High input voltage: 2.5V to 28V, SOT23-5L; Part_Type: IC; Part_Preference: Recommended; Manufacturer: STMICROELECTRONICS; Component_Country_Of_Origin: Malaysia; ShowFields: YES; ID: 4620; Internal_Part_Number: MCD-02514; Value: ST730M33R; Status: Released; Manufacturer_Part_Number: ST730M33R; Package: SOT23-5L; ComponentLink1URL: http://tunmcdsvn.tun.st.com/Component_Documentation_Library/Trunk/IC/STMICROELECTRONICS_ST730M33R; Order_Code_Digikey: N/A; Order_Code_Farnell: N/A; Order_Code_RS: N/A
U36 = MCD-02706: MCU, Arm Cortex-M7 32-bit MCU, 512KB Flash, 276KB RAM, With Crypto; BMS_Part_Number: 9175300; Part_Type: IC; Part_Preference: Recommended; Manufacturer: STMICROELECTRONICS; Order_Code_RS: 135-8241; ShowFields: YES; ID: 4812; Internal_Part_Number: MCD-02706; Status: Checked; Manufacturer_Part_Number: STM32F723IEK6; Package: BGA176; ComponentLink1URL: http://tunmcdsvn.tun.st.com/Component_Documentation_Library/IC/STMICROELECTRONICS_STM32F723IEK6; Order_Code_Digikey: 497-17186-ND; Order_Code_Farnell: 2725149
U47 = MCD-00649: Common mode filter with ESD protection for USB 2.0 interface; Part_Type: Diode; Manufacturer: STMICROELECTRONICS; BMS_Part_Number: 9151138; Part_Preference: Recommended; Manufacturer_HQ_COO: EU; Component_Country_Of_Origin: China; ShowFields: YES; ID: 3094; Internal_Part_Number: MCD-00649; Status: Released; Manufacturer_Part_Number: ECMF02-2AMX6; ComponentLink1URL: http://tunmcdsvn.tun.st.com/Component_Datasheet_Library/Trunk/Diodes/STM_ESD_ECMF02-2AMX6
U48 = MCD-01207: High power Transient voltage suppressor:25V/35A EOS and ESD transients protection.; Part_Type: Diode; Manufacturer: STMICROELECTRONICS; BMS_Part_Number: 9179045; Part_Preference: Recommended; Manufacturer_HQ_COO: EU; Component_Country_Of_Origin: China; ShowFields: YES; ID: 3289; Internal_Part_Number: MCD-01207; Status: Released; Manufacturer_Part_Number: ESDA25P35-1U1M; Package: QFN1610; ComponentLink1URL: http://tunmcdsvn.tun.st.com/Component_Datasheet_Library/Trunk/Diodes/STM_ESD_ESDA25P35-1U1M
U49 = MCD-00159: 500mA, Enhanced single channel power switches with active high enable pin; Part_Type: IC; Manufacturer: STMICROELECTRONICS; Alternate_Manufacturer_Part_Number: TPS2051C; Alternate_Manufacturer: TEXAS INSTRUMENTS; BMS_Part_Number: 9159009; Manufacturer_HQ_COO: EU; Part_Preference: Recommended; Provided_By: Subcon; Initial_Board_Reference: MB1264; Component_Country_Of_Origin: Malaysia; ID: 2708; Order_Code_RS: 880-5415; ShowFields: YES; Internal_Part_Number: MCD-00159; Value: STMPS2151STR; Status: Released; Manufacturer_Part_Number: STMPS2151STR; ComponentLink1Description: Datasheet; ComponentLink1URL: http://tunmcdsvn.tun.st.com/Component_Documentation_Library/Trunk/IC/STMICROELECTRONICS_STMPS2151STR; Order_Code_Digikey: 497-6934-2-ND; Order_Code_Farnell: 1842616
U52 = MCD-02532: IC, eFuse with Fast Overvoltage Protection 2.7V to 18V 4A 34mOhm 8-Pin WSON; Part_Preference: Recommended; Manufacturer: TEXAS INSTRUMENTS; ShowFields: YES; ID: 4638; Internal_Part_Number: MCD-02532; Value: TPS259535DSG; Status: Checked; Part_Type: IC; Manufacturer_Part_Number: TPS259535DSG; Package: WSON8; ComponentLink1URL: http://tunmcdsvn.tun.st.com/Component_Documentation_Library/Trunk/IC/TEXAS_INSTRUMENTS_TPS259535DSG; Order_Code_Digikey: N/A; Order_Code_Farnell: N/A; Order_Code_RS: N/A
X7 = MCD-01036: Crystal, 24MHz, 6pF, +/-20ppm, 80R, 2x1.6mm; BMS_Part_Number: 9157045; Part_Type: Crystal_Osc; Part_Preference: Recommended; Manufacturer: NDK; Manufacturer_Part_Number: NX2016SA-24MHZ-EXS00A-CS10820; Component_Country_Of_Origin: Unknown; ID: 2989; ShowFields: YES; Internal_Part_Number: MCD-01036; Status: Released; Package: 2x1.6mm; ComponentLink1URL: http://tunmcdsvn.tun.st.com/Component_Documentation_Library/Trunk/Crytal_Oscillator/NDK_NX2016SA_Series; Order_Code_Digikey: 644-1365; Order_Code_Farnell: N/A; Order_Code_RS: N/A